# Altium schematic sheet RELAY 02.SchDoc
size C
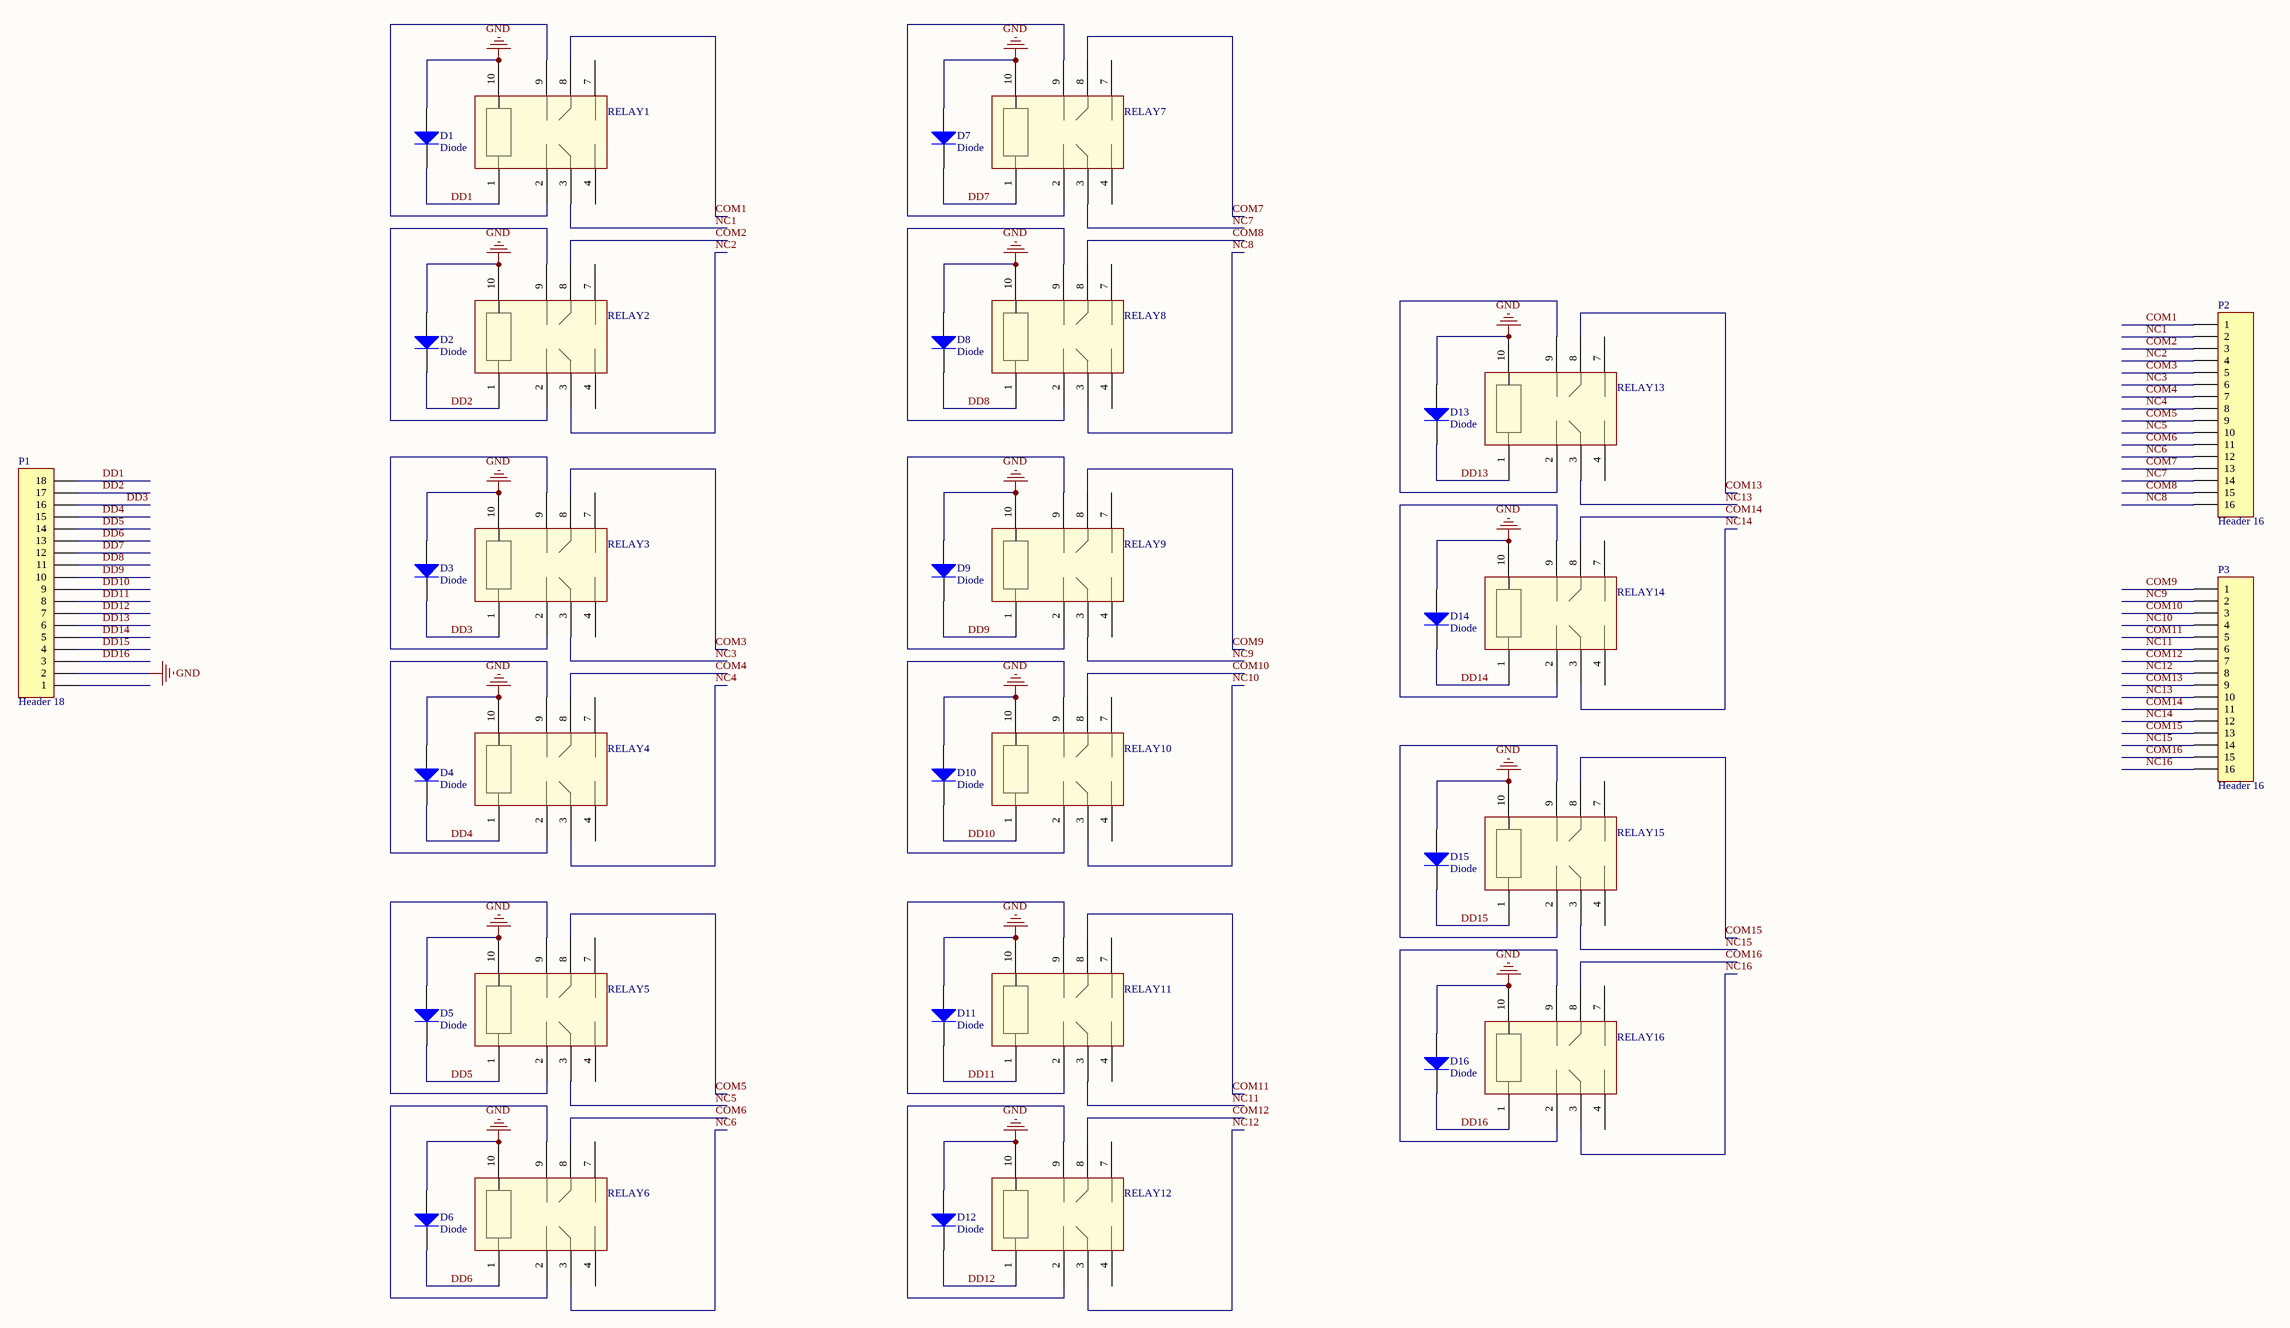
[diagram p0: RELAY 02.SchDoc]

## Parts
D1  Diode  [SMB]
D2  Diode  [SMB]
D3  Diode  [SMB]
D4  Diode  [SMB]
D5  Diode  [SMB]
D6  Diode  [SMB]
D7  Diode  [SMB]
D8  Diode  [SMB]
D9  Diode  [SMB]
D10  Diode  [SMB]
D11  Diode  [SMB]
D12  Diode  [SMB]
D13  Diode  [SMB]
D14  Diode  [SMB]
D15  Diode  [SMB]
D16  Diode  [SMB]
P1  Header 18  [CON 18]
P2  Header 16  [CON 16]
P3  Header 16  [CON 16]
RELAY1  OMRON RELAY  [G6H-2]  (value not drawn)
RELAY2  OMRON RELAY  [G6H-2]  (value not drawn)
RELAY3  OMRON RELAY  [G6H-2]  (value not drawn)
RELAY4  OMRON RELAY  [G6H-2]  (value not drawn)
RELAY5  OMRON RELAY  [G6H-2]  (value not drawn)
RELAY6  OMRON RELAY  [G6H-2]  (value not drawn)
RELAY7  OMRON RELAY  [G6H-2]  (value not drawn)
RELAY8  OMRON RELAY  [G6H-2]  (value not drawn)
RELAY9  OMRON RELAY  [G6H-2]  (value not drawn)
RELAY10  OMRON RELAY  [G6H-2]  (value not drawn)
RELAY11  OMRON RELAY  [G6H-2]  (value not drawn)
RELAY12  OMRON RELAY  [G6H-2]  (value not drawn)
RELAY13  OMRON RELAY  [G6H-2]  (value not drawn)
RELAY14  OMRON RELAY  [G6H-2]  (value not drawn)
RELAY15  OMRON RELAY  [G6H-2]  (value not drawn)
RELAY16  OMRON RELAY  [G6H-2]  (value not drawn)

## Nets
GND: D1.1(A) D2.1(A) D3.1(A) D4.1(A) D5.1(A) D6.1(A) D7.1(A) D8.1(A) D9.1(A) D10.1(A) D11.1(A) D12.1(A) D13.1(A) D14.1(A) D15.1(A) D16.1(A) P1.2 RELAY1.10 RELAY2.10 RELAY3.10 RELAY4.10 RELAY5.10 RELAY6.10 RELAY7.10 RELAY8.10 RELAY9.10 RELAY10.10 RELAY11.10 RELAY12.10 RELAY13.10 RELAY14.10 RELAY15.10 RELAY16.10
COM1: P2.1 RELAY1.8
COM2: P2.3 RELAY2.8
COM3: P2.5 RELAY3.8
COM4: P2.7 RELAY4.8
COM5: P2.9 RELAY5.8
COM6: P2.11 RELAY6.8
COM7: P2.13 RELAY7.8
COM8: P2.15 RELAY8.8
COM9: P3.1 RELAY9.8
COM10: P3.3 RELAY10.8
COM11: P3.5 RELAY11.8
COM12: P3.7 RELAY12.8
COM13: P3.9 RELAY13.8
COM14: P3.11 RELAY14.8
COM15: P3.13 RELAY15.8
COM16: P3.15 RELAY16.8
DD1: D1.2(K) P1.18 RELAY1.1
DD2: D2.2(K) P1.17 RELAY2.1
DD3: D3.2(K) P1.16 RELAY3.1
DD4: D4.2(K) P1.15 RELAY4.1
DD5: D5.2(K) P1.14 RELAY5.1
DD6: D6.2(K) P1.13 RELAY6.1
DD7: D7.2(K) P1.12 RELAY7.1
DD8: D8.2(K) P1.11 RELAY8.1
DD9: D9.2(K) P1.10 RELAY9.1
DD10: D10.2(K) P1.9 RELAY10.1
DD11: D11.2(K) P1.8 RELAY11.1
DD12: D12.2(K) P1.7 RELAY12.1
DD13: D13.2(K) P1.6 RELAY13.1
DD14: D14.2(K) P1.5 RELAY14.1
DD15: D15.2(K) P1.4 RELAY15.1
DD16: D16.2(K) P1.3 RELAY16.1
NC1: P2.2 RELAY1.3
NC2: P2.4 RELAY2.3
NC3: P2.6 RELAY3.3
NC4: P2.8 RELAY4.3
NC5: P2.10 RELAY5.3
NC6: P2.12 RELAY6.3
NC7: P2.14 RELAY7.3
NC8: P2.16 RELAY8.3
NC9: P3.2 RELAY9.3
NC10: P3.4 RELAY10.3
NC11: P3.6 RELAY11.3
NC12: P3.8 RELAY12.3
NC13: P3.10 RELAY13.3
NC14: P3.12 RELAY14.3
NC15: P3.14 RELAY15.3
NC16: P3.16 RELAY16.3
NetRELAY1_2: RELAY1.2 RELAY1.9
NetRELAY2_2: RELAY2.2 RELAY2.9
NetRELAY3_2: RELAY3.2 RELAY3.9
NetRELAY4_2: RELAY4.2 RELAY4.9
NetRELAY5_2: RELAY5.2 RELAY5.9
NetRELAY6_2: RELAY6.2 RELAY6.9
NetRELAY7_2: RELAY7.2 RELAY7.9
NetRELAY8_2: RELAY8.2 RELAY8.9
NetRELAY9_2: RELAY9.2 RELAY9.9
NetRELAY10_2: RELAY10.2 RELAY10.9
NetRELAY11_2: RELAY11.2 RELAY11.9
NetRELAY12_2: RELAY12.2 RELAY12.9
NetRELAY13_2: RELAY13.2 RELAY13.9
NetRELAY14_2: RELAY14.2 RELAY14.9
NetRELAY15_2: RELAY15.2 RELAY15.9
NetRELAY16_2: RELAY16.2 RELAY16.9

Not connected (* = marked no-connect by the designer): P1 1; RELAY1 4 5 6 7; RELAY2 4 5 6 7; RELAY3 4 5 6 7; RELAY4 4 5 6 7; RELAY5 4 5 6 7; RELAY6 4 5 6 7; RELAY7 4 5 6 7; RELAY8 4 5 6 7; RELAY9 4 5 6 7; RELAY10 4 5 6 7; RELAY11 4 5 6 7; RELAY12 4 5 6 7; RELAY13 4 5 6 7; RELAY14 4 5 6 7; RELAY15 4 5 6 7; RELAY16 4 5 6 7

## Library data of the parts
D1-D16 = Diode: Default Diode; Published: 8-Jun-2000; LatestRevisionDate: 17-Jul-2002; LatestRevisionNote: Re-released for DXP Platform.; PackageVersion: Sep-1996; PackageReference: SMC; Publisher: Altium Limited; PackageDescription: DO-214-AB/SMC; 2 C-Bend Leads; Body 7.9 x 5.9 mm, inc. leads (LxW); Code_JEDEC: DO-214-AB
P1 = Header 18: Header, 18-Pin; LatestRevisionDate: 17-Jul-2002; LatestRevisionNote: Re-released for DXP Platform.; Publisher: Altium Limited
P2 P3 = Header 16: Header, 16-Pin; LatestRevisionDate: 17-Jul-2002; LatestRevisionNote: Re-released for DXP Platform.; Publisher: Altium Limited
RELAY1-RELAY16 = OMRON G6H-2